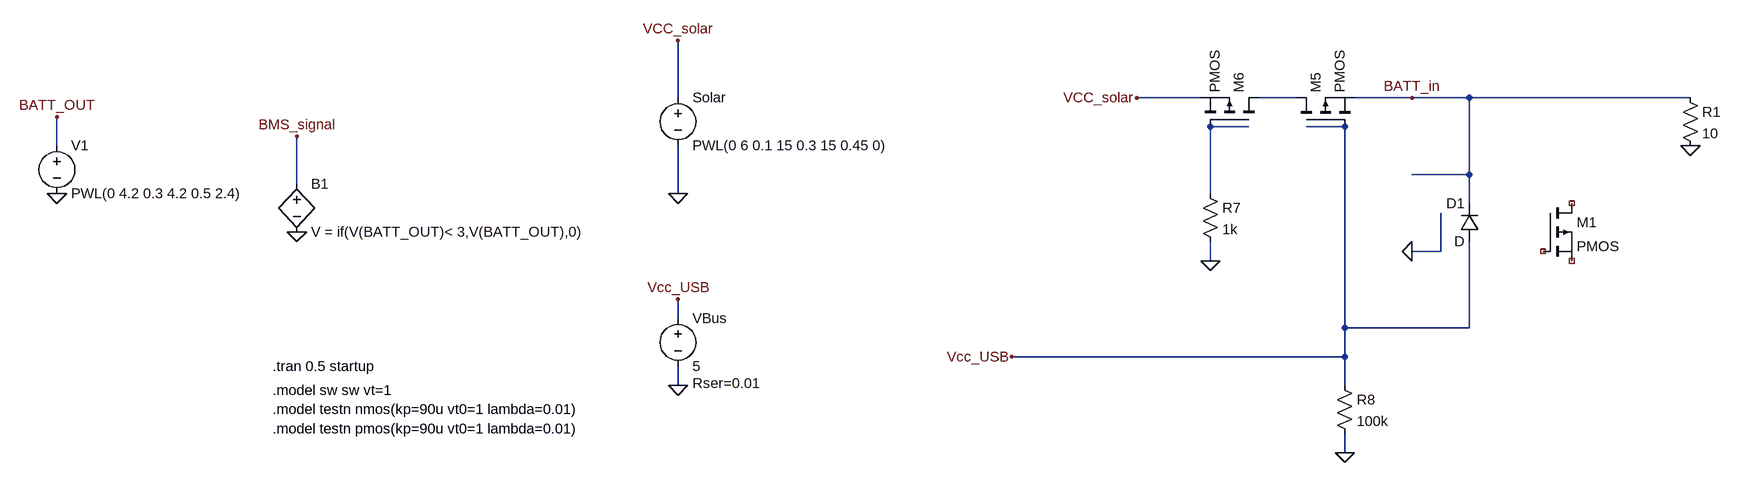
[diagram p0: schematic test_pmos.asc]
test_pmos.asc, the LTspice schematic file:
Version 4
SHEET 1 2972 2036
WIRE -224 48 -224 -48
WIRE 976 48 704 48
WIRE 1136 48 1072 48
WIRE 1328 48 1232 48
WIRE 1424 48 1328 48
WIRE 2224 48 1424 48
WIRE 1056 96 992 96
WIRE 1216 96 1152 96
WIRE -1296 128 -1296 80
WIRE 1424 176 1424 48
WIRE 1424 176 1328 176
WIRE -896 192 -896 112
WIRE -224 208 -224 128
WIRE 992 208 992 96
WIRE 1424 224 1424 176
WIRE 1376 304 1376 240
WIRE 1376 304 1328 304
WIRE 992 320 992 288
WIRE -224 416 -224 384
WIRE 1216 432 1216 96
WIRE 1424 432 1424 288
WIRE 1424 432 1216 432
WIRE 1216 480 1216 432
WIRE 1216 480 496 480
WIRE -224 528 -224 496
WIRE 1216 528 1216 480
WIRE 1216 640 1216 608
FLAG -224 208 0
FLAG -224 528 0
FLAG 992 320 0
FLAG 1216 640 0
FLAG 1328 48 BATT_in
FLAG -224 -48 VCC_solar
FLAG 704 48 VCC_solar
FLAG -224 384 Vcc_USB
FLAG 496 480 Vcc_USB
FLAG -896 112 BMS_signal
FLAG -896 272 0
FLAG 2224 128 0
FLAG -1296 208 0
FLAG -1296 80 BATT_OUT
FLAG 1328 304 0
SYMBOL voltage -224 32 R0
WINDOW 123 0 0 Left 0
WINDOW 39 0 0 Left 0
SYMATTR InstName Solar
SYMATTR Value PWL(0 6 0.1 15 0.3 15 0.45 0)
SYMBOL voltage -224 400 R0
WINDOW 123 0 0 Left 0
WINDOW 39 24 124 Left 2
SYMATTR SpiceLine Rser=0.01
SYMATTR InstName VBus
SYMATTR Value 5
SYMBOL pmos 1136 96 R270
SYMATTR InstName M5
SYMBOL pmos 1072 96 M270
SYMATTR InstName M6
SYMBOL res 976 192 R0
SYMATTR InstName R7
SYMATTR Value 1k
SYMBOL res 1200 512 R0
SYMATTR InstName R8
SYMATTR Value 100k
SYMBOL bv -896 176 R0
SYMATTR InstName B1
SYMATTR Value V = if(V(BATT_OUT)< 3,V(BATT_OUT),0)
SYMBOL res 2208 32 R0
SYMATTR InstName R1
SYMATTR Value 10
SYMBOL pmos 1600 224 R0
SYMATTR InstName M1
SYMBOL voltage -1296 112 R0
SYMATTR InstName V1
SYMATTR Value PWL(0 4.2 0.3 4.2 0.5 2.4)
SYMBOL diode 1440 288 R180
WINDOW 0 24 64 Left 2
WINDOW 3 24 0 Left 2
SYMATTR InstName D1
TEXT -936 496 Left 2 !.tran 0.5 startup
TEXT -936 536 Left 2 !.model sw sw vt=1
TEXT -936 568 Left 2 !.model testn nmos(kp=90u vt0=1 lambda=0.01)
TEXT -936 600 Left 2 !.model testn pmos(kp=90u vt0=1 lambda=0.01)

The netlist it stands for:
* test_pmos.asc
V§Solar VCC_solar 0 PWL(0 6 0.1 15 0.3 15 0.45 0)
VBus Vcc_USB 0 5 Rser=0.01
M5 N001 Vcc_USB BATT_in BATT_in PMOS
M6 N001 N002 VCC_solar VCC_solar PMOS
R7 N002 0 1k
R8 Vcc_USB 0 100k
B1 BMS_signal 0 V = if(V(BATT_OUT)< 3,V(BATT_OUT),0)
R1 BATT_in 0 10
M1 NC_01 NC_02 NC_03 NC_03 PMOS
V1 BATT_OUT 0 PWL(0 4.2 0.3 4.2 0.5 2.4)
D1 Vcc_USB BATT_in D
.model D D
.lib standard.dio
.model NMOS NMOS
.model PMOS PMOS
.lib standard.mos
.tran 0.5 startup
.model sw sw vt=1
.model testn nmos(kp=90u vt0=1 lambda=0.01)
.model testn pmos(kp=90u vt0=1 lambda=0.01)
.backanno
.end